# EasyEDA schematic P03_DISPLAY_TOUCH.json
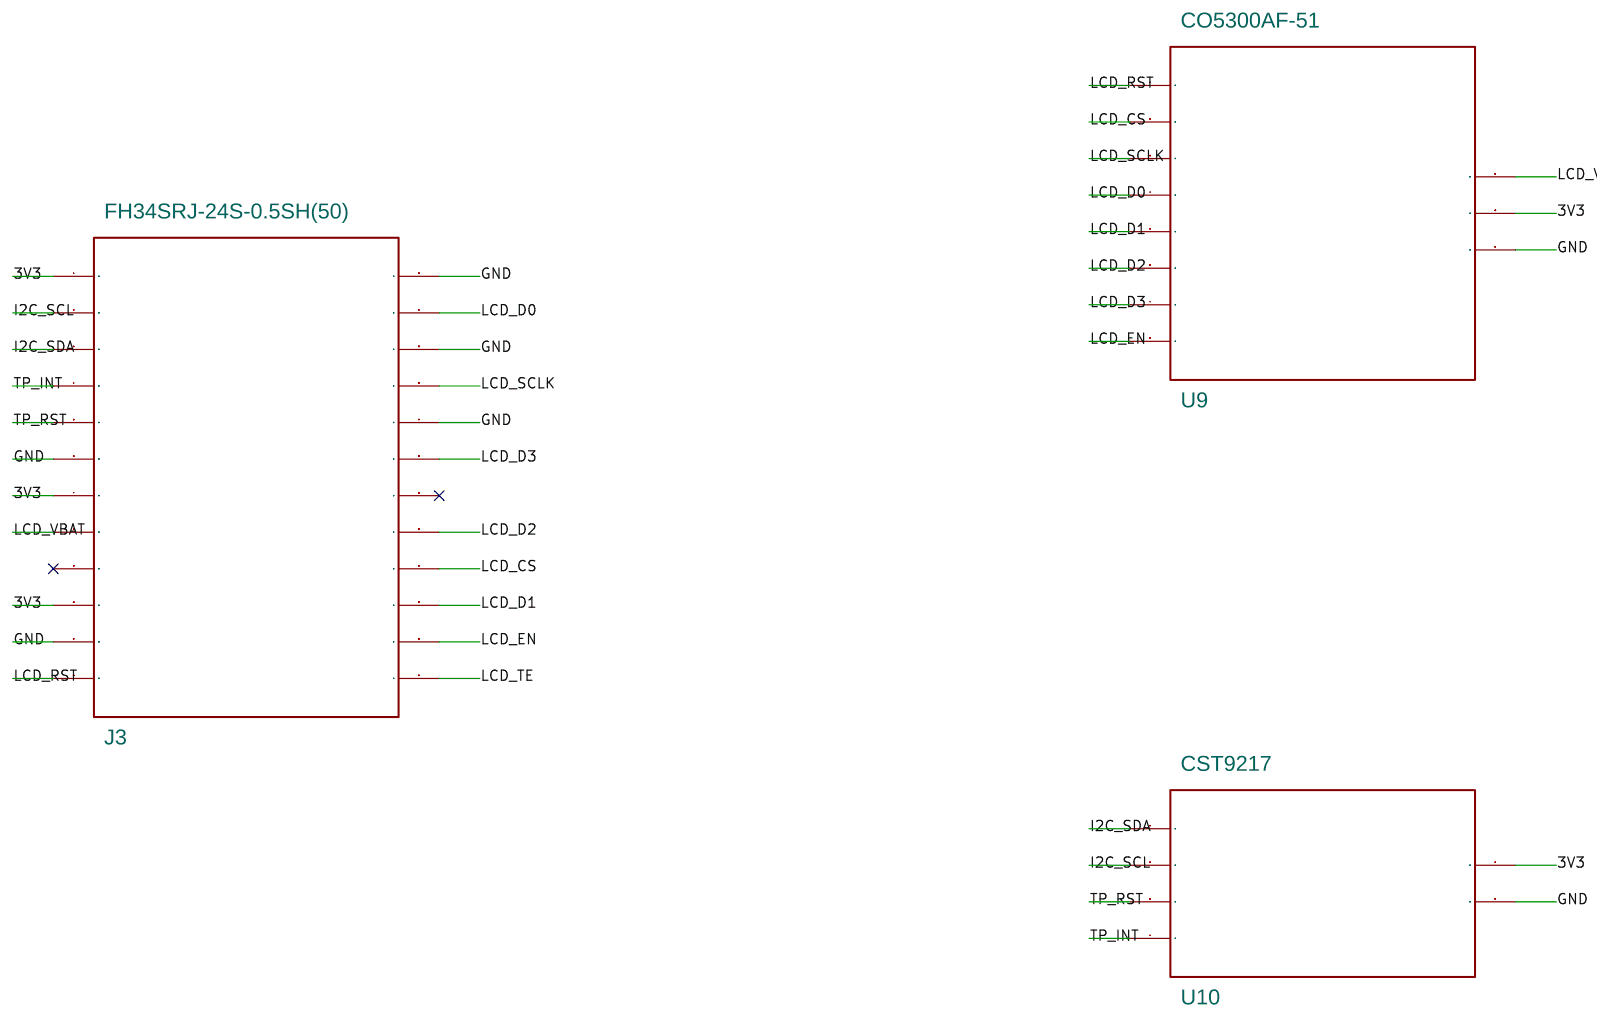
[diagram p0: schematic sheet]

## Parts
J3  FH34SRJ-24S-0.5SH(50)  [FPC-24-0.5]
U9  CO5300AF-51  [CO5300]
U10  CST9217  [CST9217]

## Library data of the parts
J3 = FPC_24P
U9 = AMOLED_Controller
U10 = Touch_Controller

## Nets
3V3: J3.1 J3.7(1) J3.10(1) U9.10(1) U10.5(1)
GND: J3.6(1) J3.11(1) J3.13(1) J3.15(1) J3.17(1) U9.11(1) U10.6(1)
I2C_SCL: J3.2(1) U10.2(1)
I2C_SDA: J3.3(1) U10.1
LCD_CS: J3.21(1) U9.2(1)
LCD_D0: J3.14(1) U9.4(1)
LCD_D1: J3.22(1) U9.5(1)
LCD_D2: J3.20(1) U9.6(1)
LCD_D3: J3.18(1) U9.7(1)
LCD_EN: J3.23(1) U9.8(1)
LCD_RST: J3.12(1) U9.1
LCD_SCLK: J3.16(1) U9.3(1)
LCD_TE: J3.24(1)
LCD_VBAT: J3.8(1) U9.9(1)
TP_INT: J3.4(1) U10.4(1)
TP_RST: J3.5(1) U10.3(1)

Not connected (* = marked no-connect by the designer): J3 9(1)* 19(1)*

## Notes on the sheet
- P03  PY206-W38-V2 / CO5300 / CST9217 24-pin FPC
- 目标资料：docs/hardware/3593896291PY206-W38-V2(2).pdf，第 3–4 页针脚表。
- 连接器首选 FH34SRJ-24S-0.5SH(50)，LCSC C324726；封装高度/双面接触待实物验证。
- 24-pin FPC：第 8 脚首版接 VBAT_SW；正反面、接触方向、OLED_EN 有效极性必须实物核对。
